# Altium schematic sheet TopLevel.SchDoc: =project_title
size Tabloid; PageSetup: Record=PageOptions|CenterHorizontal=True|CenterVertical=True|PrintScale=0.73|XCorrection=1.00|YCorrection=1.00|PrintKind=0|BorderSize=5000000|LeftOffset=0|BottomOffset=0|Orientation=2|PaperLength=1000|PaperWidth=1000|Scale=100|PaperSource=7|PrintQuality=-4|MediaType=1|DitherType=10|PaperKind=A4|PrintScaleMode=1; CompanyName: Luxonis Holding; Organization: Luxonis Holding; Address1: 1925 Harmony Park Drive; Address2: Westminster, CO; Address3: 80234; Address4: United States; DocumentNumber: 2; SheetNumber: 2; SheetTotal: 17
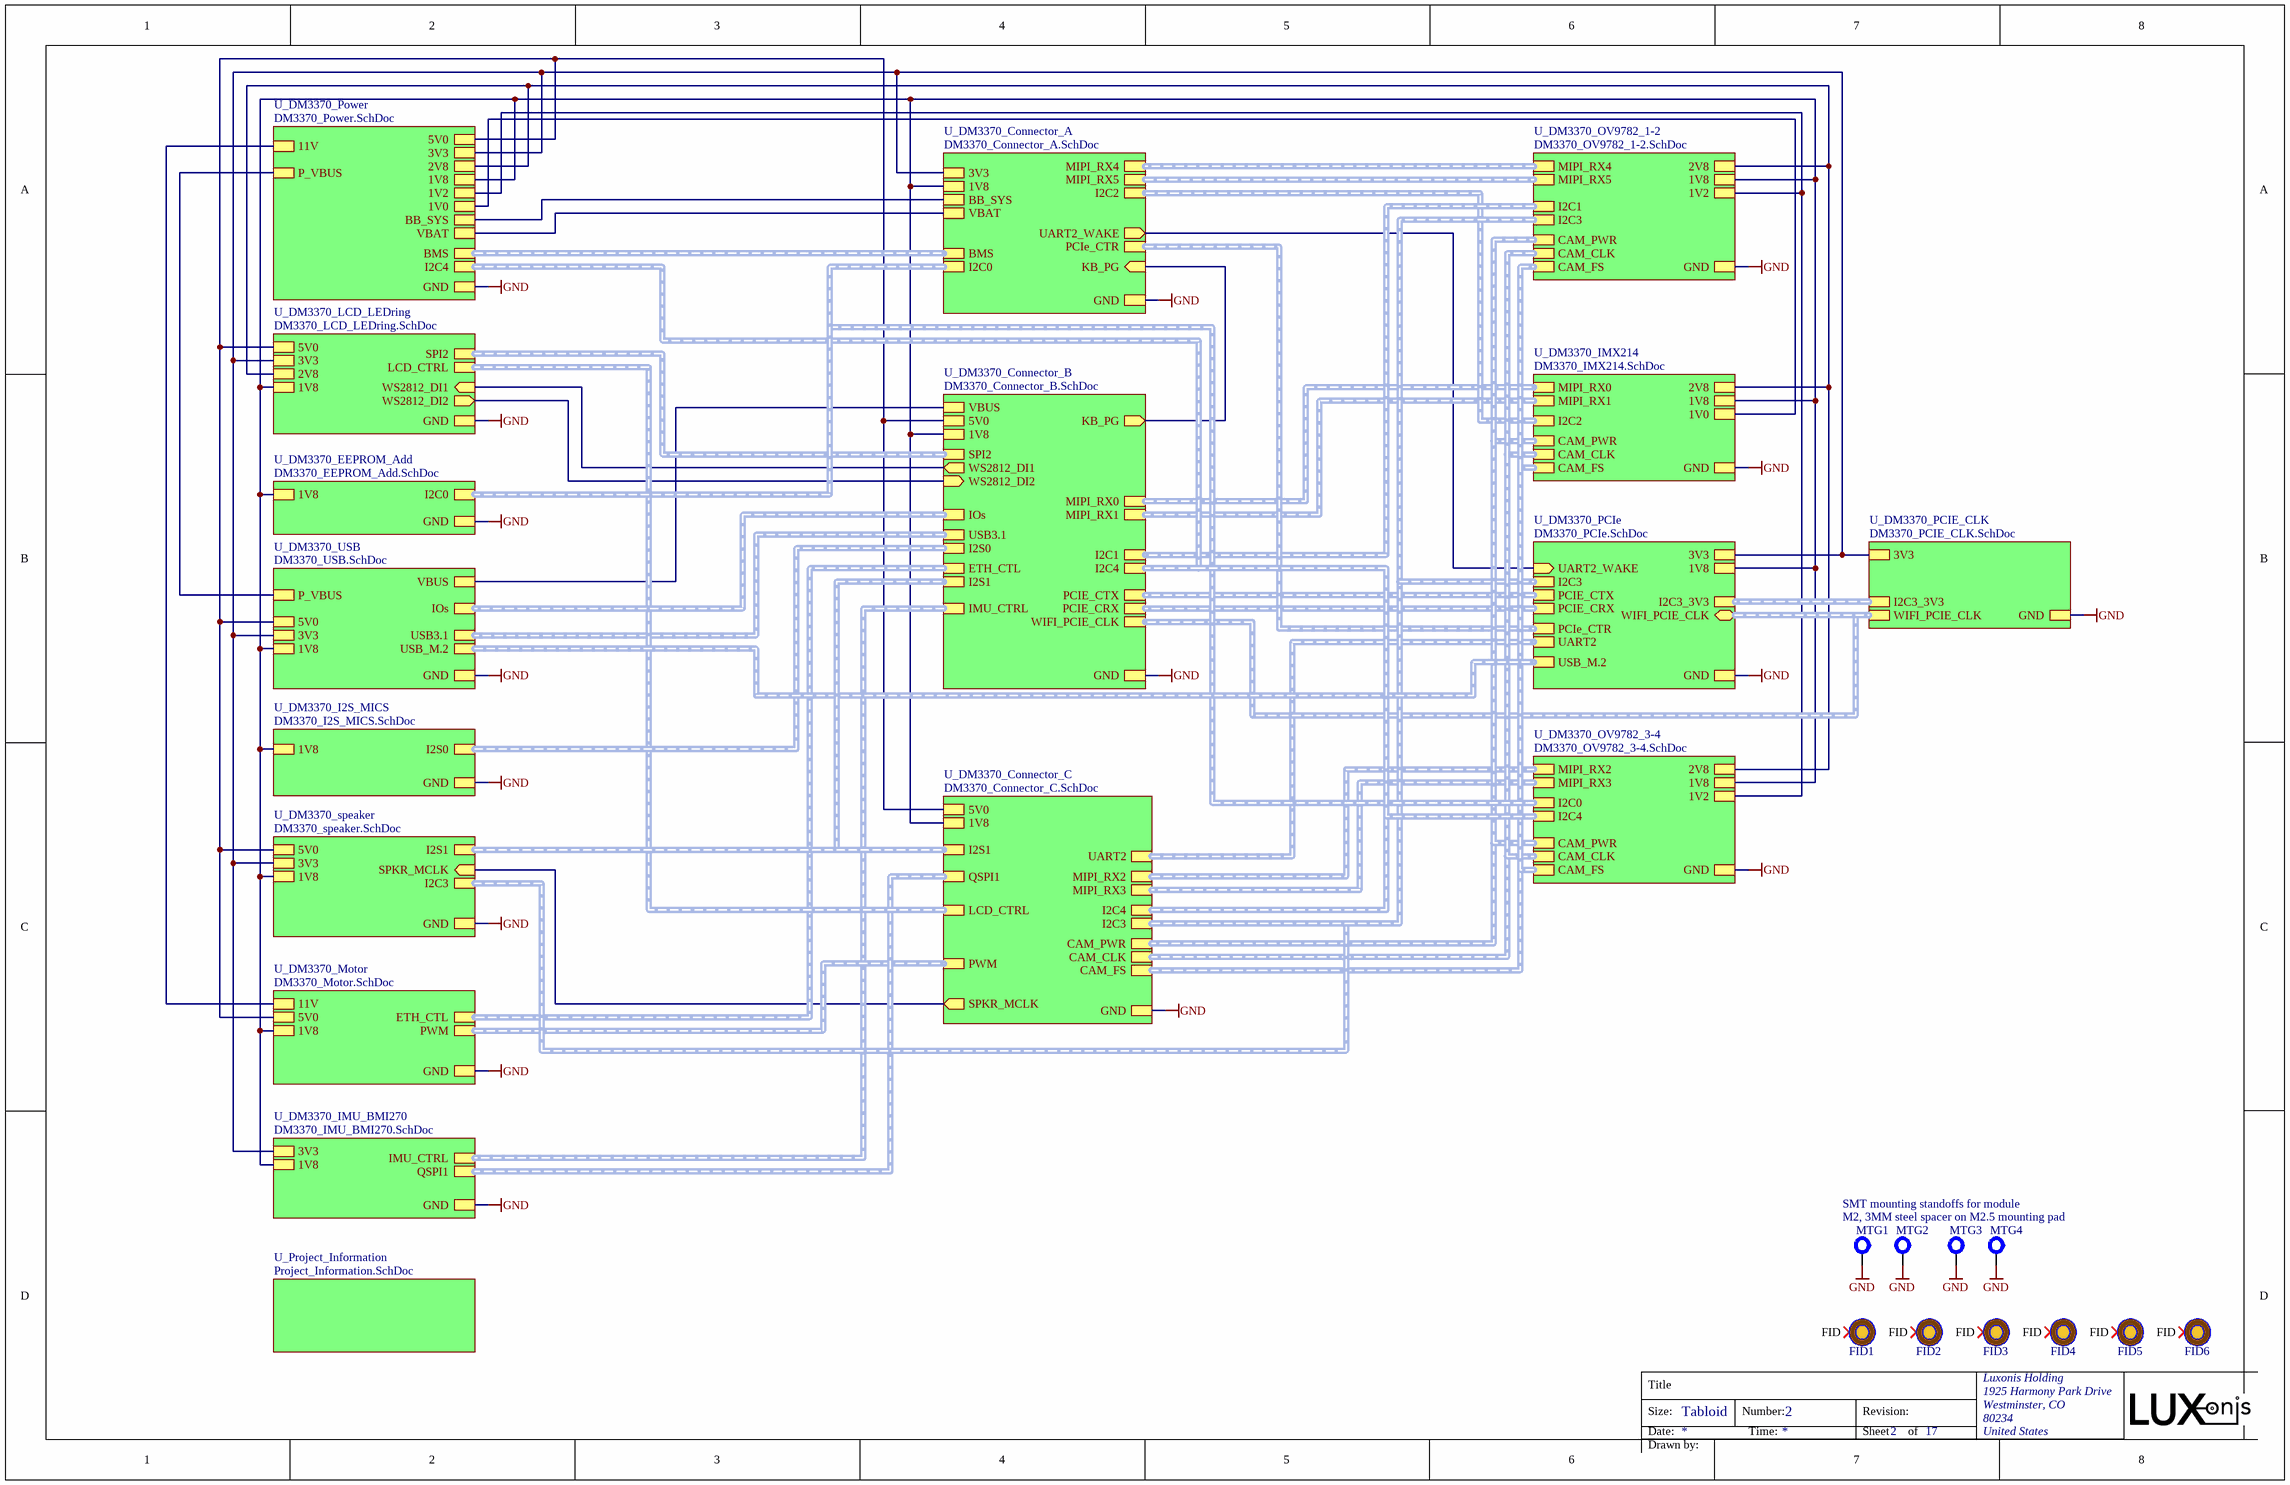
[diagram p0: TopLevel.SchDoc]

## Parts
FID1  FIDUCIAL_ROUND_1MM  [FIDUCIAL_ROUND_1MM]  (value not drawn)  (no BOM)
FID2  FIDUCIAL_ROUND_1MM  [FIDUCIAL_ROUND_1MM]  (value not drawn)  (no BOM)
FID3  FIDUCIAL_ROUND_1MM  [FIDUCIAL_ROUND_1MM]  (value not drawn)  (no BOM)
FID4  FIDUCIAL_ROUND_1MM  [FIDUCIAL_ROUND_1MM]  (value not drawn)  (no BOM)
FID5  FIDUCIAL_ROUND_1MM  [FIDUCIAL_ROUND_1MM]  (value not drawn)  (no BOM)
FID6  FIDUCIAL_ROUND_1MM  [FIDUCIAL_ROUND_1MM]  (value not drawn)  (no BOM)
MTG1  M2, 3MM steel spacer on M2.5 mounting pad  [9774030243R]
MTG2  M2, 3MM steel spacer on M2.5 mounting pad  [9774030243R]  (value not drawn)
MTG3  M2, 3MM steel spacer on M2.5 mounting pad  [9774030243R]  (value not drawn)
MTG4  M2, 3MM steel spacer on M2.5 mounting pad  [9774030243R]  (value not drawn)

## Sub-sheets
U_DM3370_Connector_A = DM3370_Connector_A.SchDoc: GND, I2C2 (harness I2C2), MIPI_RX4 (harness MIPI_RX4), MIPI_RX5 (harness MIPI_RX5), I2C0 (harness I2C0), VBAT, KB_PG (in), PCIe_CTR (harness PCIe_CTR), UART2_WAKE (out), 1V8, 3V3, BMS, BB_SYS
U_DM3370_Connector_B = DM3370_Connector_B.SchDoc: GND, VBUS, I2C4 (harness I2C4), I2S0 (harness I2S0), USB3.1 (harness USB), ETH_CTL (harness ETH_PHY_CTL), MIPI_RX0 (harness MIPI_RX0), MIPI_RX1 (harness MIPI_RX1), I2C1 (harness I2C1), PCIE_CTX (harness PCIE_CTX), PCIE_CRX (harness PCIE_CRX), SPI2 (harness SPI2), IMU_CTRL (harness IMU_CTRL), 1V8, KB_PG (out), 5V0, WIFI_PCIE_CLK, WS2812_DI1 (out), WS2812_DI2 (in), IOs (harness USB), I2S1
U_DM3370_Connector_C = DM3370_Connector_C.SchDoc: GND, MIPI_RX2 (harness MIPI_RX2), MIPI_RX3 (harness MIPI_RX3), I2C3 (harness I2C3), QSPI1 (harness QSPI1), UART2 (harness UART2), I2C4 (harness I2C4), CAM_FS, CAM_CLK, CAM_PWR, 1V8, LCD_CTRL (harness USB_DRP_CTRL), SPKR_MCLK (out), PWM (harness KBIOs), 5V0, I2S1
U_DM3370_EEPROM_Add = DM3370_EEPROM_Add.SchDoc: 1V8, GND, I2C0 (harness I2C0)
U_DM3370_I2S_MICS = DM3370_I2S_MICS.SchDoc: 1V8, GND, I2S0 (harness I2S0)
U_DM3370_IMU_BMI270 = DM3370_IMU_BMI270.SchDoc: GND, 3V3, 1V8, IMU_CTRL (harness IMU_CTRL), QSPI1 (harness SPI0)
U_DM3370_IMX214 = DM3370_IMX214.SchDoc: I2C2 (harness I2C2), CAM_PWR (harness CAM_PWR), CAM_CLK (harness CAM_CLK), CAM_FS (harness CAM_FS), 2V8, 1V0, GND, 1V8, MIPI_RX0 (harness MIPI_RX0), MIPI_RX1 (harness MIPI_RX1)
U_DM3370_LCD_LEDring = DM3370_LCD_LEDring.SchDoc: 2V8, GND, 5V0, 1V8, SPI2 (harness SPI2), LCD_CTRL (harness LCD_CTRL), WS2812_DI1 (in), WS2812_DI2 (out), 3V3
U_DM3370_Motor = DM3370_Motor.SchDoc: 11V, GND, 1V8, ETH_CTL (harness ETH_PHY_CTL), PWM (harness KBIOs), 5V0
U_DM3370_OV9782_1-2 = DM3370_OV9782_1-2.SchDoc: 2V8, GND, I2C1 (harness I2C1), CAM_PWR (harness CAM_PWR), CAM_CLK (harness CAM_CLK), CAM_FS (harness CAM_FS), 1V2, 1V8, I2C3 (harness I2C3), MIPI_RX5 (harness MIPI_RX4), MIPI_RX4 (harness MIPI_RX4)
U_DM3370_OV9782_3-4 = DM3370_OV9782_3-4.SchDoc: 1V2, GND, CAM_PWR (harness CAM_PWR), CAM_CLK (harness CAM_CLK), CAM_FS (harness CAM_FS), 2V8, 1V8, I2C0 (harness I2C0), I2C4 (harness I2C4), MIPI_RX2 (harness MIPI_RX2), MIPI_RX3 (harness MIPI_RX3)
U_DM3370_PCIe = DM3370_PCIe.SchDoc: PCIE_CTX (harness PCIE_CTX), PCIE_CRX (harness PCIE_CRX), GND, 3V3, 1V8, PCIe_CTR (harness PCIe_CTR), UART2 (harness UART2), UART2_WAKE (in), WIFI_PCIE_CLK (bidir, harness WIFI_PCIE_CLK), I2C3_3V3 (harness I2C3_3V3), I2C3, USB_M.2
U_DM3370_PCIE_CLK = DM3370_PCIE_CLK.SchDoc: 3V3, GND, WIFI_PCIE_CLK (harness WIFI_PCIE_CLK), I2C3_3V3 (harness I2C3_3V3)
U_DM3370_Power = DM3370_Power.SchDoc: 11V, GND, 5V0, 3V3, 1V8, VBAT, P_VBUS, 1V2, 1V0, 2V8, I2C4 (harness I2C4), BMS (harness BMS), BB_SYS
U_DM3370_speaker = DM3370_speaker.SchDoc: 1V8, GND, I2S1 (harness I2S0), SPKR_MCLK (in), 3V3, 5V0, I2C3
U_DM3370_USB = DM3370_USB.SchDoc: VBUS, GND, 3V3, 5V0, 1V8, P_VBUS, USB3.1 (harness USB_KB), USB_M.2 (harness USB_MAX1), IOs
U_Project_Information = Project_Information.SchDoc: no entries

## Nets
GND: MTG1.1 MTG2.1 MTG3.1 MTG4.1 ; sheet U_DM3370_EEPROM_Add/GND, sheet U_DM3370_Connector_A/GND, sheet U_DM3370_Connector_B/GND, sheet U_DM3370_Connector_C/GND, sheet U_DM3370_IMU_BMI270/GND, sheet U_DM3370_LCD_LEDring/GND, sheet U_DM3370_Motor/GND, sheet U_DM3370_OV9782_1-2/GND, sheet U_DM3370_OV9782_3-4/GND, sheet U_DM3370_PCIe/GND, sheet U_DM3370_IMX214/GND, sheet U_DM3370_Power/GND, sheet U_DM3370_USB/GND, sheet U_DM3370_PCIE_CLK/GND, sheet U_DM3370_I2S_MICS/GND, sheet U_DM3370_speaker/GND
(unnamed): sheet U_DM3370_EEPROM_Add/1V8, sheet U_DM3370_Connector_A/1V8, sheet U_DM3370_Connector_B/1V8, sheet U_DM3370_Connector_C/1V8, sheet U_DM3370_IMU_BMI270/1V8, sheet U_DM3370_LCD_LEDring/1V8, sheet U_DM3370_Motor/1V8, sheet U_DM3370_OV9782_1-2/1V8, sheet U_DM3370_OV9782_3-4/1V8, sheet U_DM3370_PCIe/1V8, sheet U_DM3370_IMX214/1V8, sheet U_DM3370_Power/1V8, sheet U_DM3370_USB/1V8, sheet U_DM3370_I2S_MICS/1V8, sheet U_DM3370_speaker/1V8
(unnamed): sheet U_DM3370_Connector_A/VBAT, sheet U_DM3370_Power/VBAT
(unnamed): sheet U_DM3370_Connector_A/KB_PG, sheet U_DM3370_Connector_B/KB_PG
(unnamed): sheet U_DM3370_Connector_A/UART2_WAKE, sheet U_DM3370_PCIe/UART2_WAKE
(unnamed): sheet U_DM3370_Connector_A/3V3, sheet U_DM3370_IMU_BMI270/3V3, sheet U_DM3370_LCD_LEDring/3V3, sheet U_DM3370_PCIe/3V3, sheet U_DM3370_Power/3V3, sheet U_DM3370_USB/3V3, sheet U_DM3370_PCIE_CLK/3V3, sheet U_DM3370_speaker/3V3
(unnamed): sheet U_DM3370_Connector_A/BB_SYS, sheet U_DM3370_Power/BB_SYS
(unnamed): sheet U_DM3370_Connector_B/VBUS, sheet U_DM3370_USB/VBUS
(unnamed): sheet U_DM3370_Connector_B/5V0, sheet U_DM3370_Connector_C/5V0, sheet U_DM3370_LCD_LEDring/5V0, sheet U_DM3370_Motor/5V0, sheet U_DM3370_Power/5V0, sheet U_DM3370_USB/5V0, sheet U_DM3370_speaker/5V0
(unnamed): sheet U_DM3370_Connector_B/WS2812_DI1, sheet U_DM3370_LCD_LEDring/WS2812_DI1
(unnamed): sheet U_DM3370_Connector_B/WS2812_DI2, sheet U_DM3370_LCD_LEDring/WS2812_DI2
(unnamed): sheet U_DM3370_Connector_C/SPKR_MCLK, sheet U_DM3370_speaker/SPKR_MCLK
(unnamed): sheet U_DM3370_LCD_LEDring/2V8, sheet U_DM3370_OV9782_1-2/2V8, sheet U_DM3370_OV9782_3-4/2V8, sheet U_DM3370_IMX214/2V8, sheet U_DM3370_Power/2V8
(unnamed): sheet U_DM3370_Motor/11V, sheet U_DM3370_Power/11V
(unnamed): sheet U_DM3370_OV9782_1-2/1V2, sheet U_DM3370_OV9782_3-4/1V2, sheet U_DM3370_Power/1V2
(unnamed): sheet U_DM3370_IMX214/1V0, sheet U_DM3370_Power/1V0
(unnamed): sheet U_DM3370_Power/P_VBUS, sheet U_DM3370_USB/P_VBUS

Not connected (* = marked no-connect by the designer): FID1 FID*; FID2 FID*; FID3 FID*; FID4 FID*; FID5 FID*; FID6 FID*

## Buses and harness runs
harness sheet U_DM3370_Connector_A/BMS = sheet U_DM3370_Power/BMS
harness sheet U_DM3370_Connector_A/I2C0 = sheet U_DM3370_EEPROM_Add/I2C0 = sheet U_DM3370_OV9782_3-4/I2C0
harness sheet U_DM3370_Connector_A/I2C2 = sheet U_DM3370_IMX214/I2C2
harness sheet U_DM3370_Connector_A/MIPI_RX4 = sheet U_DM3370_OV9782_1-2/MIPI_RX4
harness sheet U_DM3370_Connector_A/MIPI_RX5 = sheet U_DM3370_OV9782_1-2/MIPI_RX5
harness sheet U_DM3370_Connector_A/PCIe_CTR = sheet U_DM3370_PCIe/PCIe_CTR
harness sheet U_DM3370_Connector_B/ETH_CTL = sheet U_DM3370_Motor/ETH_CTL
harness sheet U_DM3370_Connector_B/I2C1 = sheet U_DM3370_OV9782_1-2/I2C1
harness sheet U_DM3370_Connector_B/I2C4 = sheet U_DM3370_Connector_C/I2C4 = sheet U_DM3370_OV9782_3-4/I2C4 = sheet U_DM3370_Power/I2C4
harness sheet U_DM3370_Connector_B/I2S0 = sheet U_DM3370_I2S_MICS/I2S0
harness sheet U_DM3370_Connector_B/I2S1 = sheet U_DM3370_Connector_C/I2S1 = sheet U_DM3370_speaker/I2S1
harness sheet U_DM3370_Connector_B/IMU_CTRL = sheet U_DM3370_IMU_BMI270/IMU_CTRL
harness sheet U_DM3370_Connector_B/IOs = sheet U_DM3370_USB/IOs
harness sheet U_DM3370_Connector_B/MIPI_RX0 = sheet U_DM3370_IMX214/MIPI_RX0
harness sheet U_DM3370_Connector_B/MIPI_RX1 = sheet U_DM3370_IMX214/MIPI_RX1
harness sheet U_DM3370_Connector_B/PCIE_CRX = sheet U_DM3370_PCIe/PCIE_CRX
harness sheet U_DM3370_Connector_B/PCIE_CTX = sheet U_DM3370_PCIe/PCIE_CTX
harness sheet U_DM3370_Connector_B/SPI2 = sheet U_DM3370_LCD_LEDring/SPI2
harness sheet U_DM3370_Connector_B/USB3.1 = sheet U_DM3370_USB/USB3.1
harness sheet U_DM3370_Connector_B/WIFI_PCIE_CLK = sheet U_DM3370_PCIe/WIFI_PCIE_CLK = sheet U_DM3370_PCIE_CLK/WIFI_PCIE_CLK
harness sheet U_DM3370_Connector_C/CAM_CLK = sheet U_DM3370_IMX214/CAM_CLK = sheet U_DM3370_OV9782_1-2/CAM_CLK = sheet U_DM3370_OV9782_3-4/CAM_CLK
harness sheet U_DM3370_Connector_C/CAM_FS = sheet U_DM3370_IMX214/CAM_FS = sheet U_DM3370_OV9782_1-2/CAM_FS = sheet U_DM3370_OV9782_3-4/CAM_FS
harness sheet U_DM3370_Connector_C/CAM_PWR = sheet U_DM3370_IMX214/CAM_PWR = sheet U_DM3370_OV9782_1-2/CAM_PWR = sheet U_DM3370_OV9782_3-4/CAM_PWR
harness sheet U_DM3370_Connector_C/I2C3 = sheet U_DM3370_OV9782_1-2/I2C3 = sheet U_DM3370_PCIe/I2C3 = sheet U_DM3370_speaker/I2C3
harness sheet U_DM3370_Connector_C/LCD_CTRL = sheet U_DM3370_LCD_LEDring/LCD_CTRL
harness sheet U_DM3370_Connector_C/MIPI_RX2 = sheet U_DM3370_OV9782_3-4/MIPI_RX2
harness sheet U_DM3370_Connector_C/MIPI_RX3 = sheet U_DM3370_OV9782_3-4/MIPI_RX3
harness sheet U_DM3370_Connector_C/PWM = sheet U_DM3370_Motor/PWM
harness sheet U_DM3370_Connector_C/QSPI1 = sheet U_DM3370_IMU_BMI270/QSPI1
harness sheet U_DM3370_Connector_C/UART2 = sheet U_DM3370_PCIe/UART2
harness sheet U_DM3370_PCIe/I2C3_3V3 = sheet U_DM3370_PCIE_CLK/I2C3_3V3
harness sheet U_DM3370_PCIe/USB_M.2 = sheet U_DM3370_USB/USB_M.2

## Notes on the sheet
- SMT mounting standoffs for module
- Title
- Size:
- Date:
- Tabloid
- Number:
- Time:
- Revision:
- Sheet
- of
- Drawn by:

## Library data of the parts
FID1-FID6 = FIDUCIAL: Fiducial with various available footprints
MTG1-MTG4 = 9774030243R: MP ROUND STANDOFF M2X0.4 STEEL 3MM; Manufacturer 1: Wurth Electronics; Plating: Tin; Threaded/Unthreaded: Threaded; Outside Diameter: 0.171inch; Supplier 1: Digi-Key; Manufacturer Part Number 1: 9774030243R; Stock 1: 20568; Pricing 1: 1=0.95000, 10=0.91800, 50=0.79500, 100=0.73900 (USD); RoHS: Yes; Material: Steel; Length: 0.173inch; REACH SVHC: Unknown; ComponentLink1URL: http://www.mouser.com/ds/2/445/9774030243R-611455.pdf?src-supplier=Mouser; ComponentLink1Description: http://www.mouser.com/ds/2/445/9774030243R-611455.pdf?src-supplier=Mouser; ComponentLink2URL: http://www.farnell.com/datasheets/1960368.pdf?src-supplier=Farnell; ComponentLink2Description: http://www.farnell.com/datasheets/1960368.pdf?src-supplier=Farnell; ComponentLink3URL: https://katalog.we-online.de/em/datasheet/9774030243R.pdf?src-supplier=Digi-Key; ComponentLink3Description: https://katalog.we-online.de/em/datasheet/9774030243R.pdf?src-supplier=Digi-Key; ComponentLink4URL: http://www.farnell.com/datasheets/1960368.pdf?src-supplier=Newark; ComponentLink4Description: http://www.farnell.com/datasheets/1960368.pdf?src-supplier=Newark; ComponentLink5URL: http://www.farnell.com/datasheets/1960368.pdf?src-supplier=Element14; ComponentLink5Description: http://www.farnell.com/datasheets/1960368.pdf?src-supplier=Element14; Supplier Part Number 1: 732-7085-1-ND; Supplier 2: Mouser; Supplier Part Number 2: 710-9774030243R; Supplier 3: Element14; Supplier Part Number 3: 2497599